# EasyEDA Pro project ZigbeeAirPurifier_EasyEDA_Project.epro

# Schematic AirPurifier

## Sheets
1 ESP32Peripherals: Board Name: MainPCB; Create Date: 2025-09-23; Page Name: ESP32Peripherals; Project Name: ZigbeeAirPurifier; Schematic Name: AirPurifier; Update Date: 2025-09-23; Company: EasyEDA.com; Page Size: A4; Version: V1.0
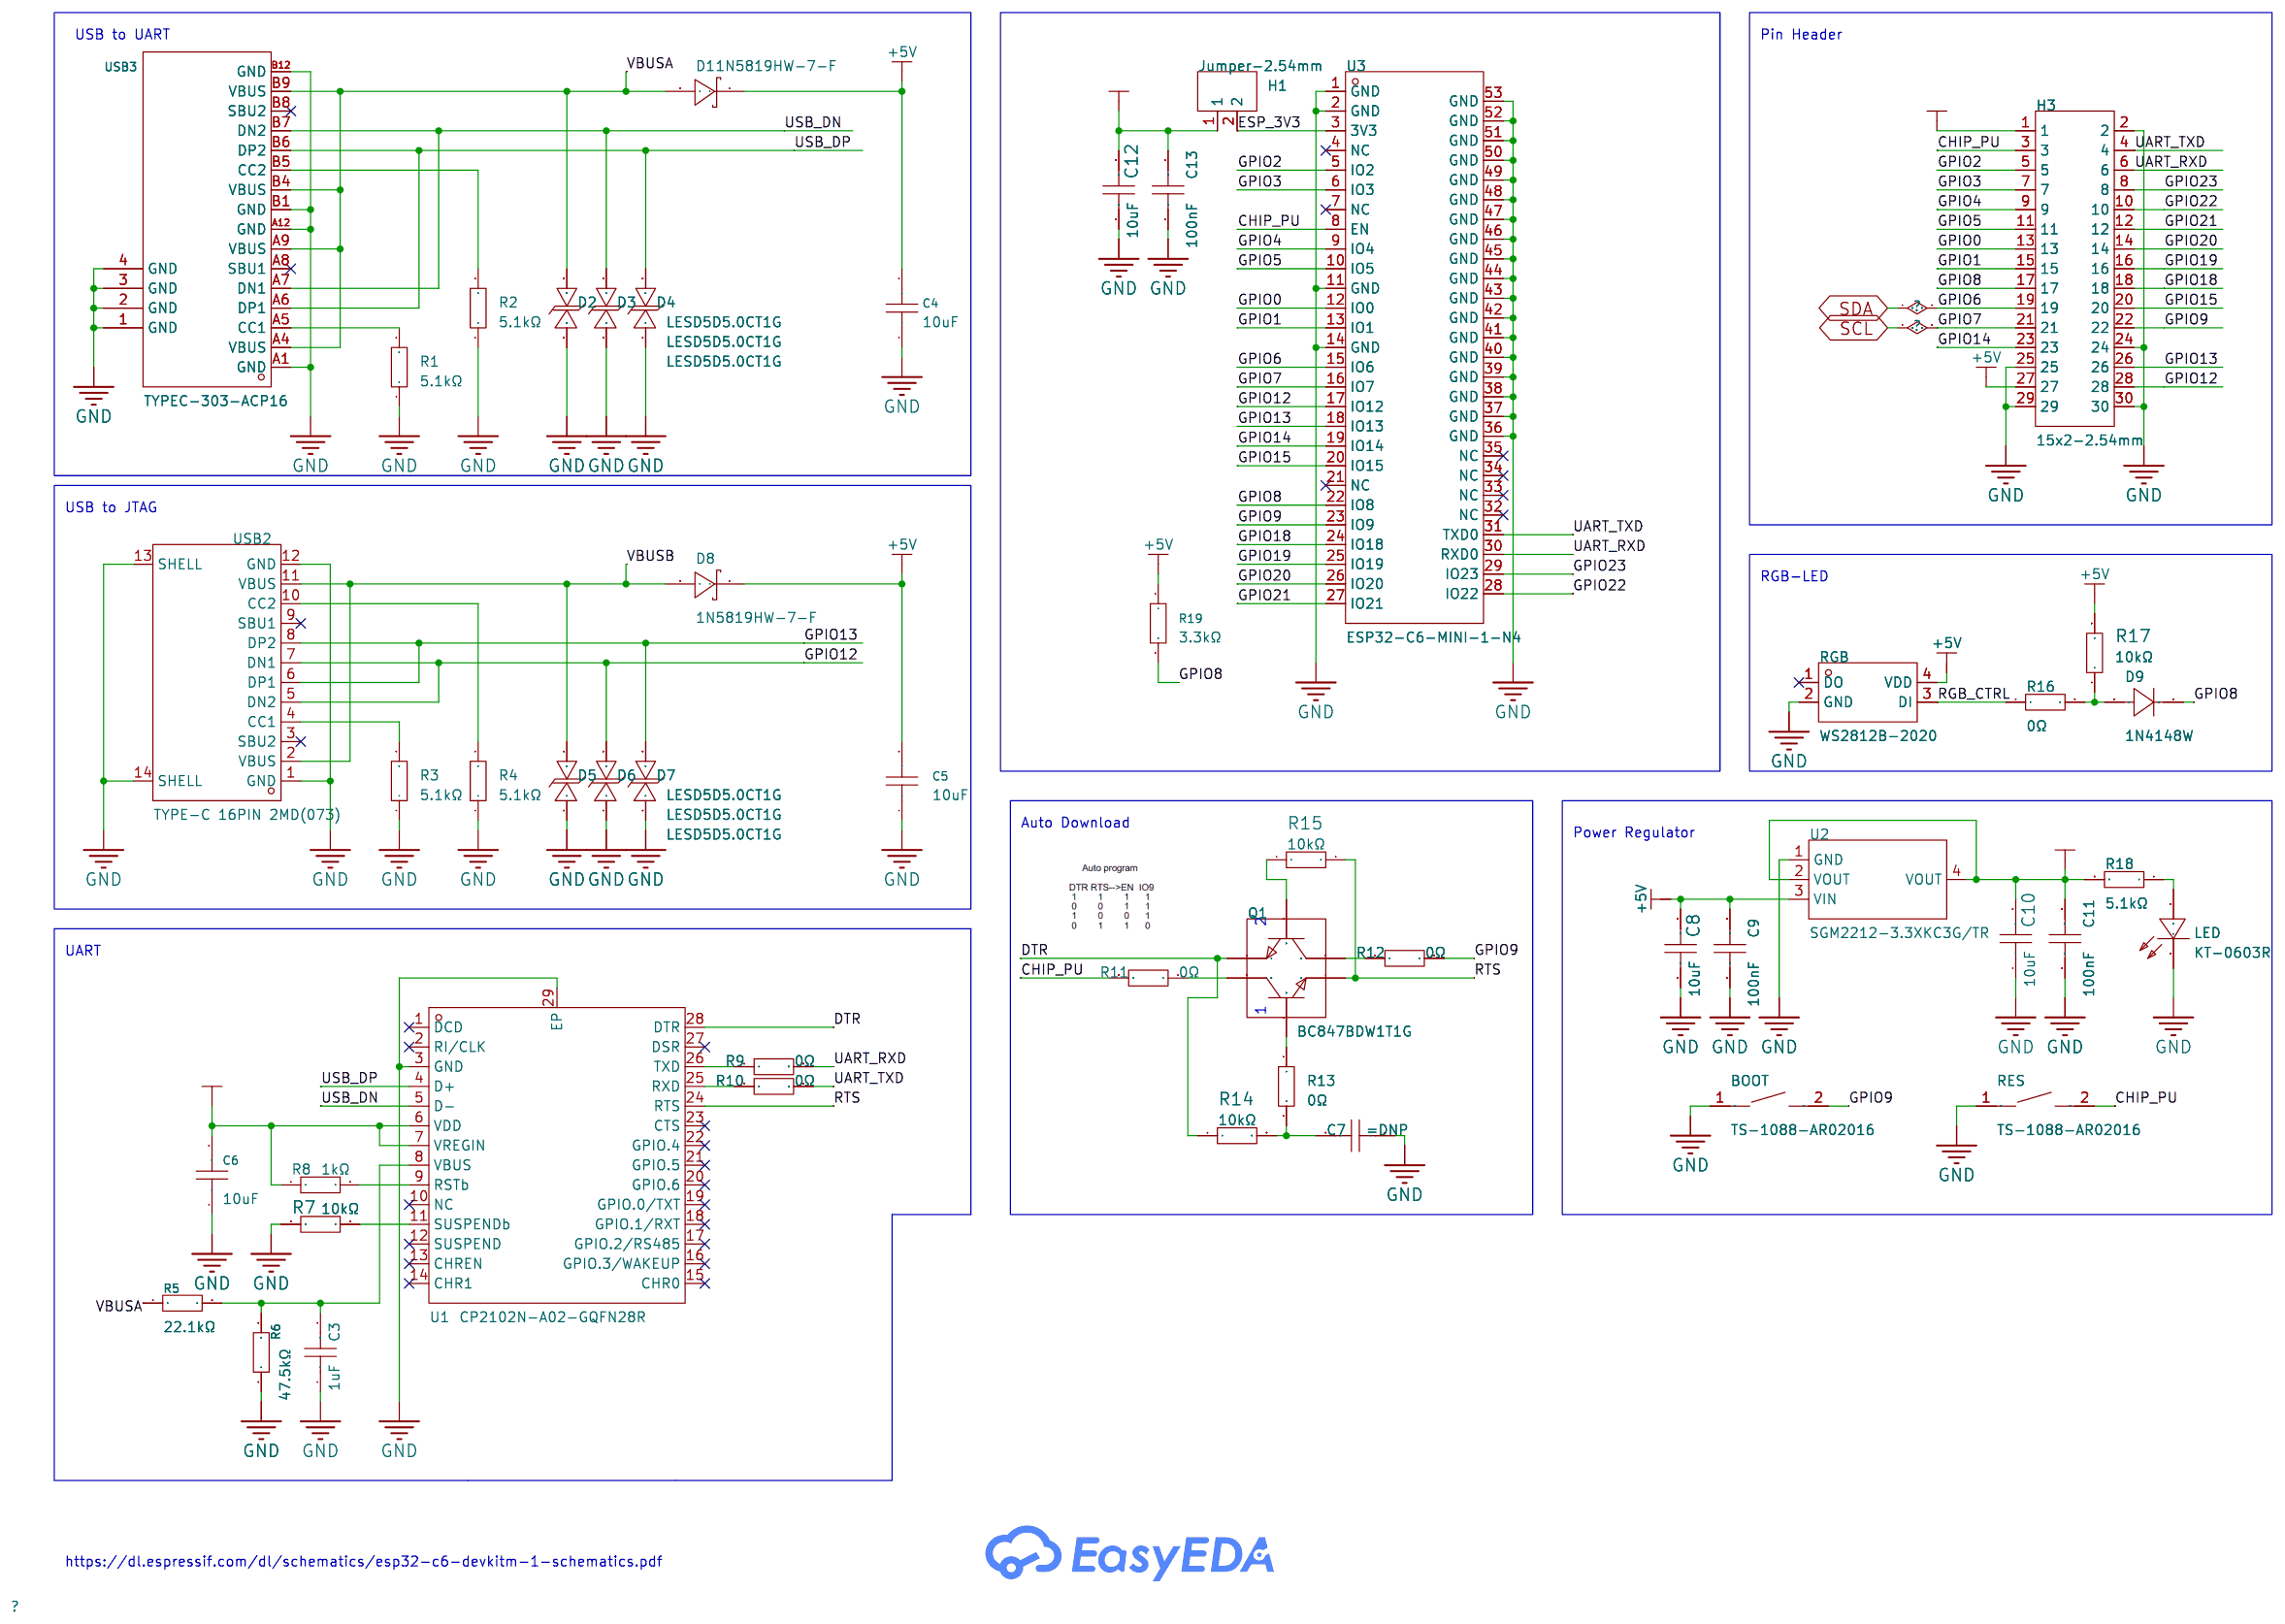
[diagram p0: ESP32Peripherals]
2 PWMFanControl: Page Name: PWMFanControl
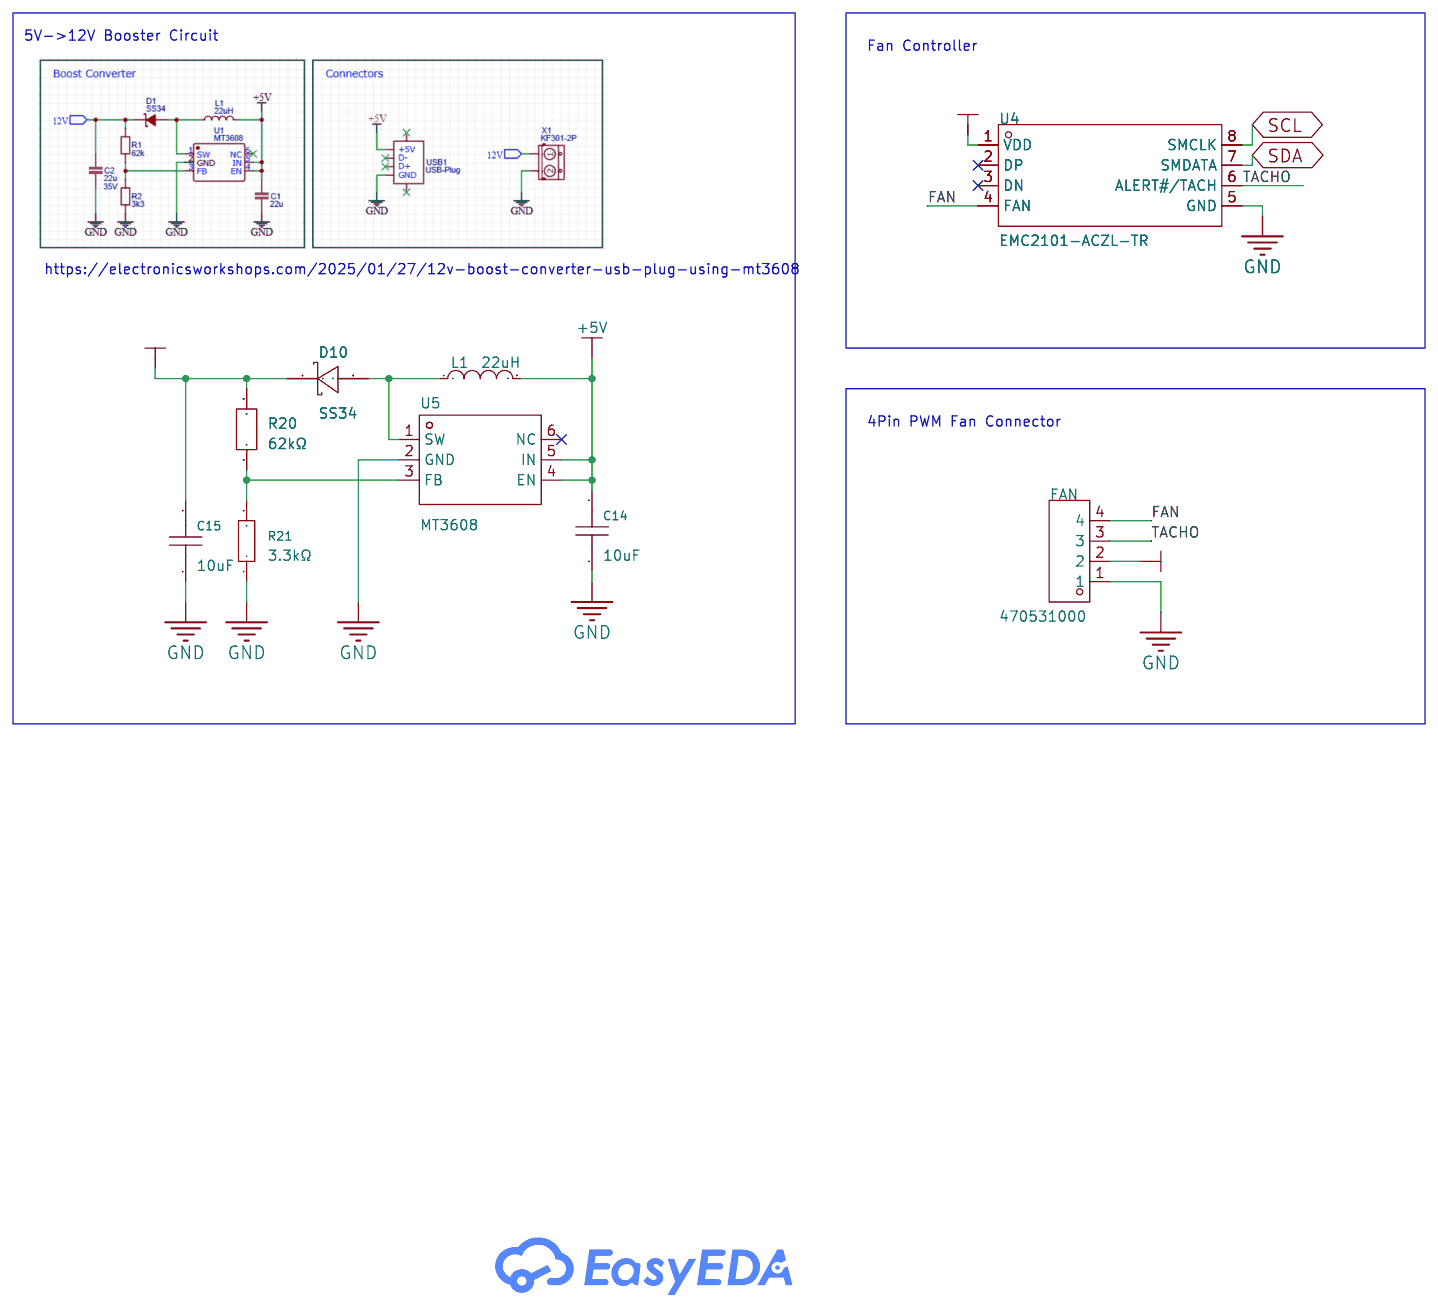
[diagram p1: PWMFanControl]

## Parts
sheet ESP32Peripherals
BOOT  TS-1088-AR02016  [SW-SMD_L3.9-W3.0-P4.45]
C3  1uF  [C0603]
C4  10uF  [C0603]
C5  10uF  [C0603]
C6  10uF  [C0603]
C7  1uF  [C0603]
C8  10uF  [C0603]
C9  100nF  [C0603]
C10  10uF  [C0603]
C11  100nF  [C0603]
C12  10uF  [C0603]
C13  100nF  [C0603]
D1  1N5819HW-7-F  [SOD-123_L2.7-W1.6-LS3.7-RD]
D2  LESD5D5.0CT1G  [SOD-523_L1.2-W0.8-LS1.6-BI]
D3  LESD5D5.0CT1G  [SOD-523_L1.2-W0.8-LS1.6-BI]
D4  LESD5D5.0CT1G  [SOD-523_L1.2-W0.8-LS1.6-BI]
D5  LESD5D5.0CT1G  [SOD-523_L1.2-W0.8-LS1.6-BI]
D6  LESD5D5.0CT1G  [SOD-523_L1.2-W0.8-LS1.6-BI]
D7  LESD5D5.0CT1G  [SOD-523_L1.2-W0.8-LS1.6-BI]
D8  1N5819HW-7-F  [SOD-123_L2.7-W1.6-LS3.7-RD]
D9  1N4148W  [SOD-123_L2.8-W1.8-LS3.7-RD-1]
H1  Jumper-2.54mm  [HDR-TH_2P-P2.54-V-M]
H3  15x2-2.54mm  [HDR-TH_30P-P2.54-V-M-R2-C15-S2.54-BL]
LED  KT-0603R  [LED0603-RD]
Q1  BC847BDW1T1G  [SOT-363_L2.0-W1.3-P0.65-LS2.1-TL]
R1  5.1kΩ  [R0603]
R2  5.1kΩ  [R0603]
R3  5.1kΩ  [R0603]
R4  5.1kΩ  [R0603]
R5  22.1kΩ  [R0603]
R6  47.5kΩ  [R0603]
R7  10kΩ  [R0603]
R8  1kΩ  [R0603]
R9  0Ω  [R0603]
R10  0Ω  [R0603]
R11  0Ω  [R0603]
R12  0Ω  [R0603]
R13  0Ω  [R0603]
R14  10kΩ  [R0603]
R15  10kΩ  [R0603]
R16  0Ω  [R0603]
R17  10kΩ  [R0603]
R18  5.1kΩ  [R0603]
R19  3.3kΩ  [R0603]
RES  TS-1088-AR02016  [SW-SMD_L3.9-W3.0-P4.45]
RGB  WS2812B-2020  [LED-SMD_4P-L2.0-W2.0-TL_WS2812B-2020]
U1  CP2102N-A02-GQFN28R  [QFN-28_L5.0-W5.0-P0.50-TL-EP3.3]
U2  SGM2212-3.3XKC3G/TR  [SOT-223-3_L6.5-W3.4-P2.30-LS7.0-BR]
U3  ESP32-C6-MINI-1-N4  [WIFIM-SMD_61P-L16.6-W13.2-P0.80-ESP32-C6-MINI-1-N4]
USB2  TYPE-C 16PIN 2MD(073)  [USB-C-SMD_TYPE-C-6PIN-2MD-073]
USB3  TYPEC-303-ACP16  [USB-C-SMD_TYPEC-303-ACP16]
sheet PWMFanControl
C14  10uF  [C0603]
C15  10uF  [C0603]
D10  SS34  [SMA_L4.3-W2.6-LS5.2-RD]
FAN  470531000  [CONN-TH_47053-1000]
L1  22uH  [IND-SMD_L5.5-W5.2]
R20  62kΩ  [R0603]
R21  3.3kΩ  [R0603]
U4  EMC2101-ACZL-TR  [MSOP-8_L3.0-W3.0-P0.65-LS4.9-BL]
U5  MT3608  [SOT-23-6_L2.9-W1.6-P0.95-LS2.8-BL]

## Library data of the parts
BOOT RES = TS-1088-AR02016: Circuit:SPST Actuator Style:Round Button Operating Force:1.6N Mounting Type:Surface Mount,Vertical Length:4mm Width:3mm Switch Height:2mm with Bracket:Without Bracket Contact Current:50mA Voltage Rating:12V Actuator/Cap Color:Black Termination Style:SMD(S; LCSC Part Name: 4*3*2mm 立贴 轻触开关; Supplier Part: C720477; Manufacturer: XUNPU(讯普); Supplier Footprint: SMD; JLCPCB Part Class: Basic Part; Datasheet: https://item.szlcsc.com/datasheet/TS-1088-AR02016/763484.html; Supplier: LCSC; Circuit: SPST; Actuator Style: Round Button; Operating Force: 1.6N; Mounting Type: Surface Mount,Vertical; Length: 4mm; Width: 3mm; Switch Height: 2mm; with Bracket: Without Bracket; Contact Current: 50mA; Voltage Rating: 12V; Actuator/Cap Color: Black; Termination Style: SMD(SMT) Tab; Life: 100,000 Cycles; Operating Temperature: -30℃~+80℃
C3 C7 = CL10A105KB8NNNC: Capacitance:1uF Tolerance:±10% Tolerance:±10% Voltage Rating:50V Temperature Coefficient:X5R; LCSC Part Name: 1uF ±10% 50V; Supplier Part: C15849; Manufacturer: SAMSUNG(三星); Supplier Footprint: 0603; JLCPCB Part Class: Basic Part; Datasheet: https://item.szlcsc.com/datasheet/CL10A105KB8NNNC/16531.html; Supplier: LCSC; Tolerance: ±10%; Voltage Rating: 50V; Temperature Coefficient: X5R
C4-C6 C8 C10 C12 C14 C15 = CL10A106MQ8NNNC: Capacitance:10uF Tolerance:±20% Tolerance:±20% Voltage Rating:6.3V Temperature Coefficient:X5R; LCSC Part Name: 10uF ±20% 6.3V; Supplier Part: C1691; Manufacturer: SAMSUNG(三星); Supplier Footprint: 0603; JLCPCB Part Class: Extended Part; Datasheet: https://item.szlcsc.com/datasheet/CL10A106MQ8NNNC/2043.html; Supplier: LCSC; Tolerance: ±20%; Voltage Rating: 6.3V; Temperature Coefficient: X5R
C9 C11 C13 = CC0603KRX7R9BB104: Capacitance:100nF Tolerance:±10% Tolerance:±10% Voltage Rating:50V Temperature Coefficient:X7R; LCSC Part Name: 100nF ±10% 50V; Supplier Part: C14663; Manufacturer: YAGEO(国巨); Supplier Footprint: 0603; JLCPCB Part Class: Basic Part; Datasheet: https://item.szlcsc.com/datasheet/CC0603KRX7R9BB104/15331.html; Supplier: LCSC; Tolerance: ±10%; Voltage Rating: 50V; Temperature Coefficient: X7R
D1 D8 = 1N5819HW-7-F: Diode Configuration:1 Independent Voltage - Forward(Vf@If):450mV@1A Voltage - DC Reverse(Vr):40V Current - Rectified:1A Reverse Leakage Current (Ir):1mA@40V Operating Junction Temperature Range:-65℃~+150℃ Operating Junction Temperature Range:-65℃~+150℃ No; LCSC Part Name: 电压:40V 电流:1A; Supplier Part: C82544; Manufacturer: DIODES(美台); Supplier Footprint: SOD-123; JLCPCB Part Class: Extended Part; Datasheet: https://item.szlcsc.com/datasheet/1N5819HW-7-F/83701.html; Supplier: LCSC; Diode Configuration: 1 Independent; Voltage - Forward(Vf@If): 450mV@1A; Voltage - DC Reverse(Vr): 40V; Current - Rectified: 1A; Reverse Leakage Current (Ir): 1mA@40V; Operating Junction Temperature Range: -65℃~+150℃; Non-Repetitive Peak Forward Surge Current: 25A
D2-D7 = LESD5D5.0CT1G_C5199850: Supplier Part: C5199850; Manufacturer: UMW(友台半导体); Supplier Footprint: SOD-523; JLCPCB Part Class: Extended Part; Datasheet: https://atta.szlcsc.com/upload/public/pdf/source/20231109/3A3F4A5EA6FBA8B622F70BA286F4E0C0.pdf; Supplier: LCSC
D9 = 1N4148W_C917030: Diode Configuration:Independent Voltage - Forward(Vf@If):1.25V@150mA Voltage - DC Reverse(Vr):100V Current - Rectified:300mA Pd - Power Dissipation:400mW Reverse Leakage Current (Ir):1uA@75V Reverse Recovery Time (trr):8ns Operating Junction Temperature R; Supplier Part: C917030; Manufacturer: JSMSEMI(杰盛微); Supplier Footprint: SOD-123; JLCPCB Part Class: Extended Part; Datasheet: https://item.szlcsc.com/datasheet/1N4148W/991526.html; Supplier: LCSC; Diode Configuration: Independent; Voltage - Forward(Vf@If): 1.25V@150mA; Voltage - DC Reverse(Vr): 100V; Current - Rectified: 300mA; Pd - Power Dissipation: 400mW; Reverse Leakage Current (Ir): 1uA@75V; Reverse Recovery Time (trr): 8ns; Operating Junction Temperature Range: -55℃~+150℃@(Tj); Non-Repetitive Peak Forward Surge Current: 4A
H1 = PZ254V-11-02P: Pin Structure:1x2P Pitch:2.54mm Row Spacing:- Circluar Pins/Square Pins:Pin Header Mounting Type:Through Hole Number of Rows:1 Number of Pins:2P Current Rating:- Voltage Rating (Max):- Length of Mating Pin:6mm Insulation Height:2.5mm Length of End Connect; LCSC Part Name: 1x2P 间距:2.54mm 方针 直插; Supplier Part: C492401; Manufacturer: XFCN(兴飞); Supplier Footprint: 插件,P=2.54mm; JLCPCB Part Class: Extended Part; Datasheet: https://item.szlcsc.com/datasheet/PZ254V-11-02P/502957.html; Supplier: LCSC; Pin Structure: 1x2P; Pitch: 2.54mm; Circluar Pins/Square Pins: Pin Header; Mounting Type: Through Hole; Number of Rows: 1; Number of Pins: 2P; Length of Mating Pin: 6mm; Insulation Height: 2.5mm; Length of End Connection Pin: 3mm; Contact Material: Brass; Operating Temperature: -40℃~+105℃; Color: Black
H3 = X6521WV-2x15H-C60D30: Pin Structure:2x15P Pitch:2.54mm Row Spacing:2.54mm Circluar Pins/Square Pins:Policy Number of Rows:Double Row Number of Pins:30P Current Rating:3A Voltage Rating (Max):250V Length of Mating Pin:- Insulation Height:2.5mm Length of End Connection Pin:- Con; LCSC Part Name: 2x15P 间距:2.54mm 方针; Supplier Part: C725887; Manufacturer: XKB Connection(中国星坤); Supplier Footprint: 插件,P=2.54mm; JLCPCB Part Class: Extended Part; Datasheet: https://atta.szlcsc.com/upload/public/pdf/source/20230814/F1C4971E164A170E66FC7330ABFF6881.pdf; Supplier: LCSC; Pin Structure: 2x15P; Pitch: 2.54mm; Row Spacing: 2.54mm; Circluar Pins/Square Pins: Policy; Number of Rows: Double Row; Number of Pins: 30P; Current Rating: 3A; Voltage Rating (Max): 250V; Insulation Height: 2.5mm; Contact Material: Brass; Contact Plating: Gold; Operating Temperature: -40℃~+105℃; Color: Black
LED = KT-0603R: Emitted Color:Red Power Dissipation:- Forward Current:- Dominant Wavelength:- Dominant Wavelength:- Peak Wavelength:- Diode Configuration:- Lens Color:- Color Temperature:- Color Temperature:- Viewing Angle:- Mounting Sytle:- Operating Temperature:-40℃~+8; LCSC Part Name: 0603 红灯 高亮; Supplier Part: C2286; Manufacturer: KENTO; Supplier Footprint: 0603; JLCPCB Part Class: Basic Part; Datasheet: https://atta.szlcsc.com/upload/public/pdf/source/20160616/1466072038404.pdf; Supplier: LCSC; Emitted Color: Red; Operating Temperature: -40℃~+85℃
Q1 = BC847BDW1T1G: type:NPN Current - Collector(Ic):100mA Collector - Emitter Voltage VCEO:45V Pd - Power Dissipation:380mW DC Current Gain:150@10uA,5.0V DC Current Gain:150@10uA,5.0V Transition frequency(fT):100MHz Current - Collector Cutoff:5uA Vce Saturation(VCE(sat)):25; LCSC Part Name: NPN 电流:100mA 电压:45V; Supplier Part: C82368; Manufacturer: onsemi(安森美); Supplier Footprint: SOT-363; JLCPCB Part Class: Extended Part; Datasheet: https://item.szlcsc.com/datasheet/BC847BDW1T1G/83525.html; Supplier: LCSC; type: NPN; Current - Collector(Ic): 100mA; Collector - Emitter Voltage VCEO: 45V; Pd - Power Dissipation: 380mW; DC Current Gain: 150@10uA,5.0V; Transition frequency(fT): 100MHz; Current - Collector Cutoff: 5uA; Vce Saturation(VCE(sat)): 250mV; Operating Temperature: -55℃~+150℃
R1-R4 R18 = 0603WAF5101T5E: Type:Thick Film Resistor Resistance:5.1kΩ Tolerance:±1% Tolerance:±1% Power(Watts):100mW Voltage-Supply(Max):75V Temperature Coefficient:±100ppm/℃ Temperature Coefficient:±100ppm/℃ Operating Temperature:-55℃~+155℃ Operating Temperature:-55℃~+155℃; LCSC Part Name: 5.1kΩ ±1% 100mW 厚膜电阻; Supplier Part: C23186; Manufacturer: UNI-ROYAL(厚声); Supplier Footprint: 0603; JLCPCB Part Class: Basic Part; Datasheet: https://item.szlcsc.com/datasheet/0603WAF5101T5E/23913.html; Supplier: LCSC; Type: Thick Film Resistor; Tolerance: ±1%; Power(Watts): 100mW; Voltage-Supply(Max): 75V; Temperature Coefficient: ±100ppm/℃; Operating Temperature: -55℃~+155℃
R5 = 0603WAF2212T5E: Type:Thick Film Resistors Resistance:22.1kΩ Tolerance:±1% Tolerance:±1% Power(Watts): Overload Voltage (Max): Temperature Coefficient:±100ppm/℃ Temperature Coefficient:±100ppm/℃ Operating Temperature Range:-55℃~+155℃ Operating Temperature Range:-55℃~+155℃; LCSC Part Name: 22.1kΩ ±1% 100mW 厚膜电阻; Supplier Part: C25961; Manufacturer: UNI-ROYAL(厚声); Supplier Footprint: 0603; JLCPCB Part Class: Extended Part; Datasheet: https://atta.szlcsc.com/upload/public/pdf/source/20200306/C422600_1E6D84923E4A46A82E41ADD87F860B5C.pdf; Supplier: LCSC; Type: Thick Film Resistors; Tolerance: ±1%; Temperature Coefficient: ±100ppm/℃; Operating Temperature Range: -55℃~+155℃
R6 = 0603WAF4752T5E: Type:Thick Film Resistor Resistance:47.5kΩ Tolerance:±1% Tolerance:±1% Power(Watts):100mW Voltage-Supply(Max):75V Temperature Coefficient:±100ppm/℃ Temperature Coefficient:±100ppm/℃ Operating Temperature:-55℃~+155℃ Operating Temperature:-55℃~+155℃; LCSC Part Name: 47.5kΩ ±1% 100mW 厚膜电阻; Supplier Part: C23061; Manufacturer: UNI-ROYAL(厚声); Supplier Footprint: 0603; JLCPCB Part Class: Extended Part; Datasheet: https://item.szlcsc.com/datasheet/0603WAF4752T5E/23788.html; Supplier: LCSC; Type: Thick Film Resistor; Tolerance: ±1%; Power(Watts): 100mW; Voltage-Supply(Max): 75V; Temperature Coefficient: ±100ppm/℃; Operating Temperature: -55℃~+155℃
R7 R14 R15 R17 = 0603WAF1002T5E: Type:Thick Film Resistor Resistance:10kΩ Tolerance:±1% Tolerance:±1% Power(Watts):100mW Voltage-Supply(Max):75V Temperature Coefficient:±100ppm/℃ Temperature Coefficient:±100ppm/℃ Operating Temperature:-55℃~+155℃ Operating Temperature:-55℃~+155℃; LCSC Part Name: 厚膜电阻 10kΩ ±1% 100mW; Supplier Part: C25804; Manufacturer: UNI-ROYAL(厚声); Supplier Footprint: 0603; JLCPCB Part Class: Basic Part; Datasheet: https://item.szlcsc.com/datasheet/0603WAF1002T5E/26547.html; Supplier: LCSC; Type: Thick Film Resistor; Tolerance: ±1%; Power(Watts): 100mW; Voltage-Supply(Max): 75V; Temperature Coefficient: ±100ppm/℃; Operating Temperature: -55℃~+155℃
R8 = 0603WAF1001T5E: Type:Thick Film Resistors Resistance:1kΩ Tolerance:±1% Tolerance:±1% Power(Watts): Overload Voltage (Max): Temperature Coefficient:±100ppm/℃ Temperature Coefficient:±100ppm/℃ Operating Temperature Range:-55℃~+155℃ Operating Temperature Range:-55℃~+155℃; LCSC Part Name: 1kΩ ±1% 100mW 厚膜电阻; Supplier Part: C21190; Manufacturer: UNI-ROYAL(厚声); Supplier Footprint: 0603; JLCPCB Part Class: Basic Part; Datasheet: https://atta.szlcsc.com/upload/public/pdf/source/20200306/C422600_1E6D84923E4A46A82E41ADD87F860B5C.pdf; Supplier: LCSC; Type: Thick Film Resistors; Tolerance: ±1%; Temperature Coefficient: ±100ppm/℃; Operating Temperature Range: -55℃~+155℃
R9-R13 R16 = 0603WAF0000T5E: Type:Thick Film Resistor Resistance:0Ω Tolerance:±1% Tolerance:±1% Power(Watts):100mW Voltage-Supply(Max):75V Temperature Coefficient:- Temperature Coefficient:- Operating Temperature:-55℃~+155℃ Operating Temperature:-55℃~+155℃; LCSC Part Name: 0Ω ±1% 100mW 厚膜电阻; Supplier Part: C21189; Manufacturer: UNI-ROYAL(厚声); Supplier Footprint: 0603; JLCPCB Part Class: Basic Part; Datasheet: https://item.szlcsc.com/datasheet/0603WAF0000T5E/21903.html; Supplier: LCSC; Type: Thick Film Resistor; Tolerance: ±1%; Power(Watts): 100mW; Voltage-Supply(Max): 75V; Operating Temperature: -55℃~+155℃
R19 R21 = 0603WAF3301T5E: Type:Thick Film Resistor Resistance:3.3kΩ Tolerance:±1% Tolerance:±1% Power(Watts):100mW Voltage-Supply(Max):75V Temperature Coefficient:±100ppm/℃ Temperature Coefficient:±100ppm/℃ Operating Temperature:-55℃~+155℃ Operating Temperature:-55℃~+155℃; LCSC Part Name: 3.3kΩ ±1% 100mW 厚膜电阻; Supplier Part: C22978; Manufacturer: UNI-ROYAL(厚声); Supplier Footprint: 0603; JLCPCB Part Class: Basic Part; Datasheet: https://item.szlcsc.com/datasheet/0603WAF3301T5E/23705.html; Supplier: LCSC; Type: Thick Film Resistor; Tolerance: ±1%; Power(Watts): 100mW; Voltage-Supply(Max): 75V; Temperature Coefficient: ±100ppm/℃; Operating Temperature: -55℃~+155℃
RGB = WS2812B-2020: Wavelength:515.6nm；622.5nm；470.4nm Luminous Intensity:200mcd；160mcd；520mcd Fixed-Frequency Pwm Mode:- Data Transmission Rate:100KB/S Voltage - Supply:5V Voltage - Supply:5V Quiescent Current:- Lens Color:- ESD Withstand Voltage:- Installation method:op Vi; LCSC Part Name: RGB三色; Supplier Part: C965555; Manufacturer: worldsemi; Supplier Footprint: SMD,2.2x2mm; JLCPCB Part Class: Extended Part; Datasheet: https://item.szlcsc.com/datasheet/WS2812B-2020/1051115.html; Supplier: LCSC; Wavelength: 515.6nm；622.5nm；470.4nm; Luminous Intensity: 200mcd；160mcd；520mcd; Data Transmission Rate: 100KB/S; Voltage - Supply: 5V; Installation method: op View Mount
U1 = CP2102N-A02-GQFN28R: Applications Function:USB to UART USB Protocol:USB 2.0 Voltage - Supply:3V~3.6V Voltage - Supply:3V~3.6V Operating Temperature:-40℃~+85℃@(Ta) Operating Temperature:-40℃~+85℃@(Ta) Current - Supply:9.5mA Supply Current (Iq):1.3uA; Supplier Part: C964632; Manufacturer: SKYWORKS/SILICON LABS(芯科); Supplier Footprint: QFN-28-EP(5x5); JLCPCB Part Class: Extended Part; Datasheet: https://item.szlcsc.com/datasheet/CP2102N-A02-GQFN28R/1049893.html; Supplier: LCSC; Applications Function: USB to UART; USB Protocol: USB 2.0; Voltage - Supply: 3V~3.6V; Operating Temperature: -40℃~+85℃@(Ta); Current - Supply: 9.5mA; Supply Current (Iq): 1.3uA
U2 = SGM2212-3.3XKC3G/TR_C3294699: Output Type:Fixed Voltage - Supply:20V Output Voltage:3.3V Output Voltage:3.3V Output Current:800mA Power Supply Rejection Ratio (PSRR):80dB@(120Hz) Voltage Dropout:450mV@(800mA) standby current:80uA Noise:0.002%Vout Features:Short Circuit Protection；Ther; Supplier Part: C3294699; Manufacturer: SGMICRO(圣邦微); Supplier Footprint: SOT-223-3; JLCPCB Part Class: Extended Part; Datasheet: https://item.szlcsc.com/datasheet/SGM2212-3.3XKC3G%252FTR/3859121.html; Supplier: LCSC; Output Type: Fixed; Voltage - Supply: 20V; Output Voltage: 3.3V; Output Current: 800mA; Power Supply Rejection Ratio (PSRR): 80dB@(120Hz); Voltage Dropout: 450mV@(800mA); standby current: 80uA; Noise: 0.002%Vout; Features: Short Circuit Protection；Thermal Shutdown; Operating Temperature: -40℃~+125℃
U3 = ESP32-C6-MINI-1-N4: Supplier Part: C5736265; Manufacturer: ESPRESSIF(乐鑫); Supplier Footprint: SMD-53P; JLCPCB Part Class: Extended Part; Datasheet: https://item.szlcsc.com/datasheet/ESP32-C6-MINI-1-N4/6661848.html; Supplier: LCSC
USB2 = TYPE-C 16PIN 2MD(073): Connector Type:Type-C Protocol Standard:- Gender:Female Mounting Type:Surface Mount, Right Angle Number of Contacts:16P Number of Ports:1 Current Rating-Power:3A Voltage Rating:5V Connect-Disconnect Life:5,000 Cycles Supplementary Features:- Center Height; LCSC Part Name: Type-C 母 卧贴; Supplier Part: C2765186; Manufacturer: SHOU HAN(首韩); Supplier Footprint: SMD; JLCPCB Part Class: Extended Part; Datasheet: https://item.szlcsc.com/datasheet/TYPE-C%252016PIN%25202MD(073)/2901843.html; Supplier: LCSC; Connector Type: Type-C; Gender: Female; Mounting Type: Surface Mount, Right Angle; Number of Contacts: 16P; Number of Ports: 1; Current Rating-Power: 3A; Voltage Rating: 5V; Connect-Disconnect Life: 5,000 Cycles; Detection color: Black; Operating Temperature: -25℃~+85℃
USB3 = TYPEC-303-ACP16: Connector Type:Type-C Protocol Standard:- Gender:Female Mounting Type:Surface Mount,Vertical Number of Contacts:16P Number of Ports:1 Current Rating-Power:5A Voltage Rating:5V Connect-Disconnect Life:10,000 Cycles Supplementary Features:- Center Height:-; LCSC Part Name: Type-C 母 立贴; Supplier Part: C720628; Manufacturer: XUNPU(讯普); Supplier Footprint: SMD; JLCPCB Part Class: Extended Part; Datasheet: https://item.szlcsc.com/datasheet/TYPEC-303-ACP16/763635.html; Supplier: LCSC; Connector Type: Type-C; Gender: Female; Mounting Type: Surface Mount,Vertical; Number of Contacts: 16P; Number of Ports: 1; Current Rating-Power: 5A; Voltage Rating: 5V; Connect-Disconnect Life: 10,000 Cycles; Length: 6.4mm; Detection color: Black; Operating Temperature: -25℃~+85℃
D10 = SS34_C8678: Diode Configuration:Independent Voltage - Forward(Vf@If):550mV@3A Voltage - DC Reverse(Vr):40V Current - Rectified:3A Reverse Leakage Current (Ir):500uA@40V Operating Junction Temperature Range:-55℃~+125℃ Operating Junction Temperature Range:-55℃~+125℃; LCSC Part Name: 电压:40V 电流:3A; Supplier Part: C8678; Manufacturer: MDD(辰达半导体); Supplier Footprint: SMA(DO-214AC); JLCPCB Part Class: Basic Part; Datasheet: https://item.szlcsc.com/datasheet/SS34/9178.html; Supplier: LCSC; Diode Configuration: Independent; Voltage - Forward(Vf@If): 550mV@3A; Voltage - DC Reverse(Vr): 40V; Current - Rectified: 3A; Reverse Leakage Current (Ir): 500uA@40V; Operating Junction Temperature Range: -55℃~+125℃
FAN = 470531000: Pins Structure:1x4P Pitch:2.54mm Mounting Type:Through Hole Reference Series:- Number of Pins:4P Number of Rows:1 Number of PINs Per Row:4 Row Spacing:- Current Rating:- Operating Temperature:- Operating Temperature:-; LCSC Part Name: 1x4P 间距:2.54mm 直插; Supplier Part: C240840; Manufacturer: MOLEX; Supplier Footprint: 插件,P=2.54mm; JLCPCB Part Class: Extended Part; Datasheet: https://www.molex.com/content/dam/molex/molex-dot-com/products/automated/en-us/salesdrawingpdf/470/47053/470531000_sd.pdf?inline\; Supplier: LCSC; Pins Structure: 1x4P; Pitch: 2.54mm; Mounting Type: Through Hole; Number of Pins: 4P; Number of Rows: 1; Number of PINs Per Row: 4
L1 = SMMS0530-220M: Inductance:22uH Tolerance:±20% Tolerance:±20% Current Rating:1.8A Current - Saturation(Isat):2A DC Resistance(DCR):394.8mΩ Type:- Ratings:-; LCSC Part Name: 22uH ±20% 2A; Supplier Part: C2842153; Manufacturer: SXN(顺翔诺); Supplier Footprint: SMD,5.5x5.2mm; JLCPCB Part Class: Extended Part; Datasheet: https://item.szlcsc.com/datasheet/SMMS0530-220M/3026411.html; Supplier: LCSC; Tolerance: ±20%; Current Rating: 1.8A; Current - Saturation(Isat): 2A; DC Resistance(DCR): 394.8mΩ
R20 = FRC0603F6202TS: Type:Thick Film Resistor Resistance:62kΩ Tolerance:±1% Tolerance:±1% Power(Watts):100mW Voltage-Supply(Max):75V Temperature Coefficient:±100ppm/℃ Temperature Coefficient:±100ppm/℃ Operating Temperature:-55℃~+155℃ Operating Temperature:-55℃~+155℃; LCSC Part Name: 62kΩ ±1% 100mW 厚膜电阻; Supplier Part: C2907059; Manufacturer: FOJAN(富捷); Supplier Footprint: 0603; JLCPCB Part Class: Extended Part; Supplier: LCSC; Type: Thick Film Resistor; Tolerance: ±1%; Power(Watts): 100mW; Voltage-Supply(Max): 75V; Temperature Coefficient: ±100ppm/℃; Operating Temperature: -55℃~+155℃
U4 = EMC2101-ACZL-TR: LCSC Part Name: 3.6V电机驱动芯片; Supplier Part: C626967; Manufacturer: MICROCHIP(美国微芯); Supplier Footprint: MSOP-8; JLCPCB Part Class: Extended Part; Datasheet: https://item.szlcsc.com/datasheet/EMC2101-ACZL-TR/656874.html; Supplier: LCSC
U5 = MT3608: Function:Boost Output Type:Adjustable Voltage - Supply:2V~24V Voltage - Supply:2V~24V Output Voltage:- Output Voltage:- Output Current:2A Frequency - Switching:1.2MHz Frequency - Switching:1.2MHz Operating Temperature:-40℃~+85℃ Operating Temperature:-40℃~; LCSC Part Name: 老版本 高效1.2MHz 2A升压转换器; Supplier Part: C84817; Manufacturer: 西安航天民芯; Supplier Footprint: SOT-23-6; JLCPCB Part Class: Extended Part; Datasheet: https://item.szlcsc.com/datasheet/MT3608/85988.html; Supplier: LCSC; Function: Boost; Output Type: Adjustable; Voltage - Supply: 2V~24V; Output Current: 2A; Frequency - Switching: 1.2MHz; Operating Temperature: -40℃~+85℃; Synchronous Rectifier: No; Number of Outputs: 1; Topology: Boost; Quiescent Current: 100uA；1.6mA; Switch tube (built-in/external): Built-in

## Nets
+3V3: C6.2 C10.2 C11.2 C12.2 C13.2 H1.1 R8.1 R18.2 U1.6(VDD) U1.7(VREGIN) U2.2(VOUT) U2.4(VOUT) U4.1(VDD)
+5V: C4.2 C5.2 C8.2 C9.2 C14.2 D1.1(K) D8.1(K) H3.27 L1.2 R17.2 R19.1 RGB.4(VDD) U2.3(VIN) U5.4(EN) U5.5(IN)
+12V: C15.2 D10.1(K) FAN.2 R20.2
GND: BOOT.1 C3.1 C4.1 C5.1 C6.1 C7.1 C8.1 C9.1 C10.1 C11.1 C12.1 C13.1 C14.1 C15.1 D2.1 D3.1 D4.1 D5.1 D6.1 D7.1 FAN.1 H3.2 H3.24 H3.25 H3.29 H3.30 LED.1(K) R1.1 R2.1 R3.1 R4.1 R6.1 R7.1 R21.1 RES.1 RGB.2(GND) U1.3(GND) U1.29(EP) U2.1(GND) U3.1(GND) U3.2(GND) U3.11(GND) U3.14(GND) U3.36(GND) U3.37(GND) U3.38(GND) U3.39(GND) U3.40(GND) U3.41(GND) U3.42(GND) U3.43(GND) U3.44(GND) U3.45(GND) U3.46(GND) U3.47(GND) U3.48(GND) U3.49(GND) U3.50(GND) U3.51(GND) U3.52(GND) U3.53(GND) U4.5(GND) U5.2(GND) USB2.1(GND) USB2.12(GND) USB2.13(SHELL) USB2.14(SHELL) USB3.1(GND) USB3.2(GND) USB3.3(GND) USB3.4(GND) USB3.A1(GND) USB3.A12(GND) USB3.B1(GND) USB3.B12(GND)
VBUSA: D1.2(A) D2.2 R5.1 USB3.A4(VBUS) USB3.A9(VBUS) USB3.B4(VBUS) USB3.B9(VBUS)
VBUSB: D5.2 D8.2(A) USB2.2(VBUS) USB2.11(VBUS)
CHIP_PU: H3.3 R11.2 RES.2 U3.8(EN)
DTR: Q1.1(E) R14.1 U1.28(DTR)
ESP_3V3: H1.2 H3.1 U3.3(3V3)
FAN: FAN.4 U4.4(FAN)
GPIO0: H3.13 U3.12(IO0)
GPIO1: H3.15 U3.13(IO1)
GPIO2: H3.5 U3.5(IO2)
GPIO3: H3.7 U3.6(IO3)
GPIO4: H3.9 U3.9(IO4)
GPIO5: H3.11 U3.10(IO5)
GPIO6: H3.19 U3.15(IO6) U4.7(SMDATA)
GPIO7: H3.21 U3.16(IO7) U4.8(SMCLK)
GPIO8: D9.1(C) H3.17 R19.2 U3.22(IO8)
GPIO9: BOOT.2 H3.22 R12.1 U3.23(IO9)
GPIO12: D6.2 H3.28 U3.17(IO12) USB2.5(DN2) USB2.7(DN1)
GPIO13: D7.2 H3.26 U3.18(IO13) USB2.6(DP1) USB2.8(DP2)
GPIO14: H3.23 U3.19(IO14)
GPIO15: H3.20 U3.20(IO15)
GPIO18: H3.18 U3.24(IO18)
GPIO19: H3.16 U3.25(IO19)
GPIO20: H3.14 U3.26(IO20)
GPIO21: H3.12 U3.27(IO21)
GPIO22: H3.10 U3.28(IO22)
GPIO23: H3.8 U3.29(IO23)
RGB_CTRL: R16.1 RGB.3(DI)
RTS: Q1.4(E) R15.2 U1.24(RTS)
TACHO: FAN.3 U4.6(ALERT#/TACH)
UART_RXD: H3.6 R9.2 U3.30(RXD0)
UART_TXD: H3.4 R10.2 U3.31(TXD0)
USB_DN: D3.2 U1.5(D-) USB3.A7(DN1) USB3.B7(DN2)
USB_DP: D4.2 U1.4(D+) USB3.A6(DP1) USB3.B6(DP2)
Net-(C3-2): C3.2 R5.2 R6.2 U1.8(VBUS)
Net-(C7-2): C7.2 R13.2 R14.2
Net-(D9-2): D9.2(A) R16.2 R17.1
Net-(D10-2): D10.2(A) L1.1 U5.1(SW)
Net-(LED-2): LED.2(A) R18.1
Net-(Q1-2): Q1.2(B) R15.1
Net-(Q1-3): Q1.3(C) R11.1
Net-(Q1-5): Q1.5(B) R13.1
Net-(Q1-6): Q1.6(C) R12.2
Net-(R1-2): R1.2 USB3.A5(CC1)
Net-(R2-2): R2.2 USB3.B5(CC2)
Net-(R3-2): R3.2 USB2.4(CC1)
Net-(R4-2): R4.2 USB2.10(CC2)
Net-(R7-2): R7.2 U1.11(SUSPENDb)
Net-(R8-2): R8.2 U1.9(RSTb)
Net-(R9-1): R9.1 U1.26(TXD)
Net-(R10-1): R10.1 U1.25(RXD)
Net-(R20-1): R20.1 R21.2 U5.3(FB)

Not connected (* = marked no-connect by the designer): RGB 1(DO)*; U1 1(DCD)* 2(RI/CLK)* 10(NC)* 12(SUSPEND)* 13(CHREN)* 14(CHR1)* 15(CHR0)* 16(GPIO.3/WAKEUP)* 17(GPIO.2/RS485)* 18(GPIO.1/RXT)* 19(GPIO.0/TXT)* 20(GPIO.6)* 21(GPIO.5)* 22(GPIO.4)* 23(CTS)* 27(DSR)*; U3 4(NC)* 7(NC)* 21(NC)* 32(NC)* 33(NC)* 34(NC)* 35(NC)*; U4 2(DP)* 3(DN)*; U5 6(NC)*; USB2 3(SBU2)* 9(SBU1)*; USB3 A8(SBU1)* B8(SBU2)*

## Notes on the sheets
sheet 1
- USB to UART
- Pin Header
- USB to JTAG
- RGB-LED
- Auto Download
- Power Regulator
- 2
- UART
- 1
- https://dl.espressif.com/dl/schematics/esp32-c6-devkitm-1-schematics.pdf
sheet 2
- 5V->12V Booster Circuit
- Fan Controller
- https://electronicsworkshops.com/2025/01/27/12v-boost-converter-usb-plug-using-mt3608
- 4Pin PWM Fan Connector
